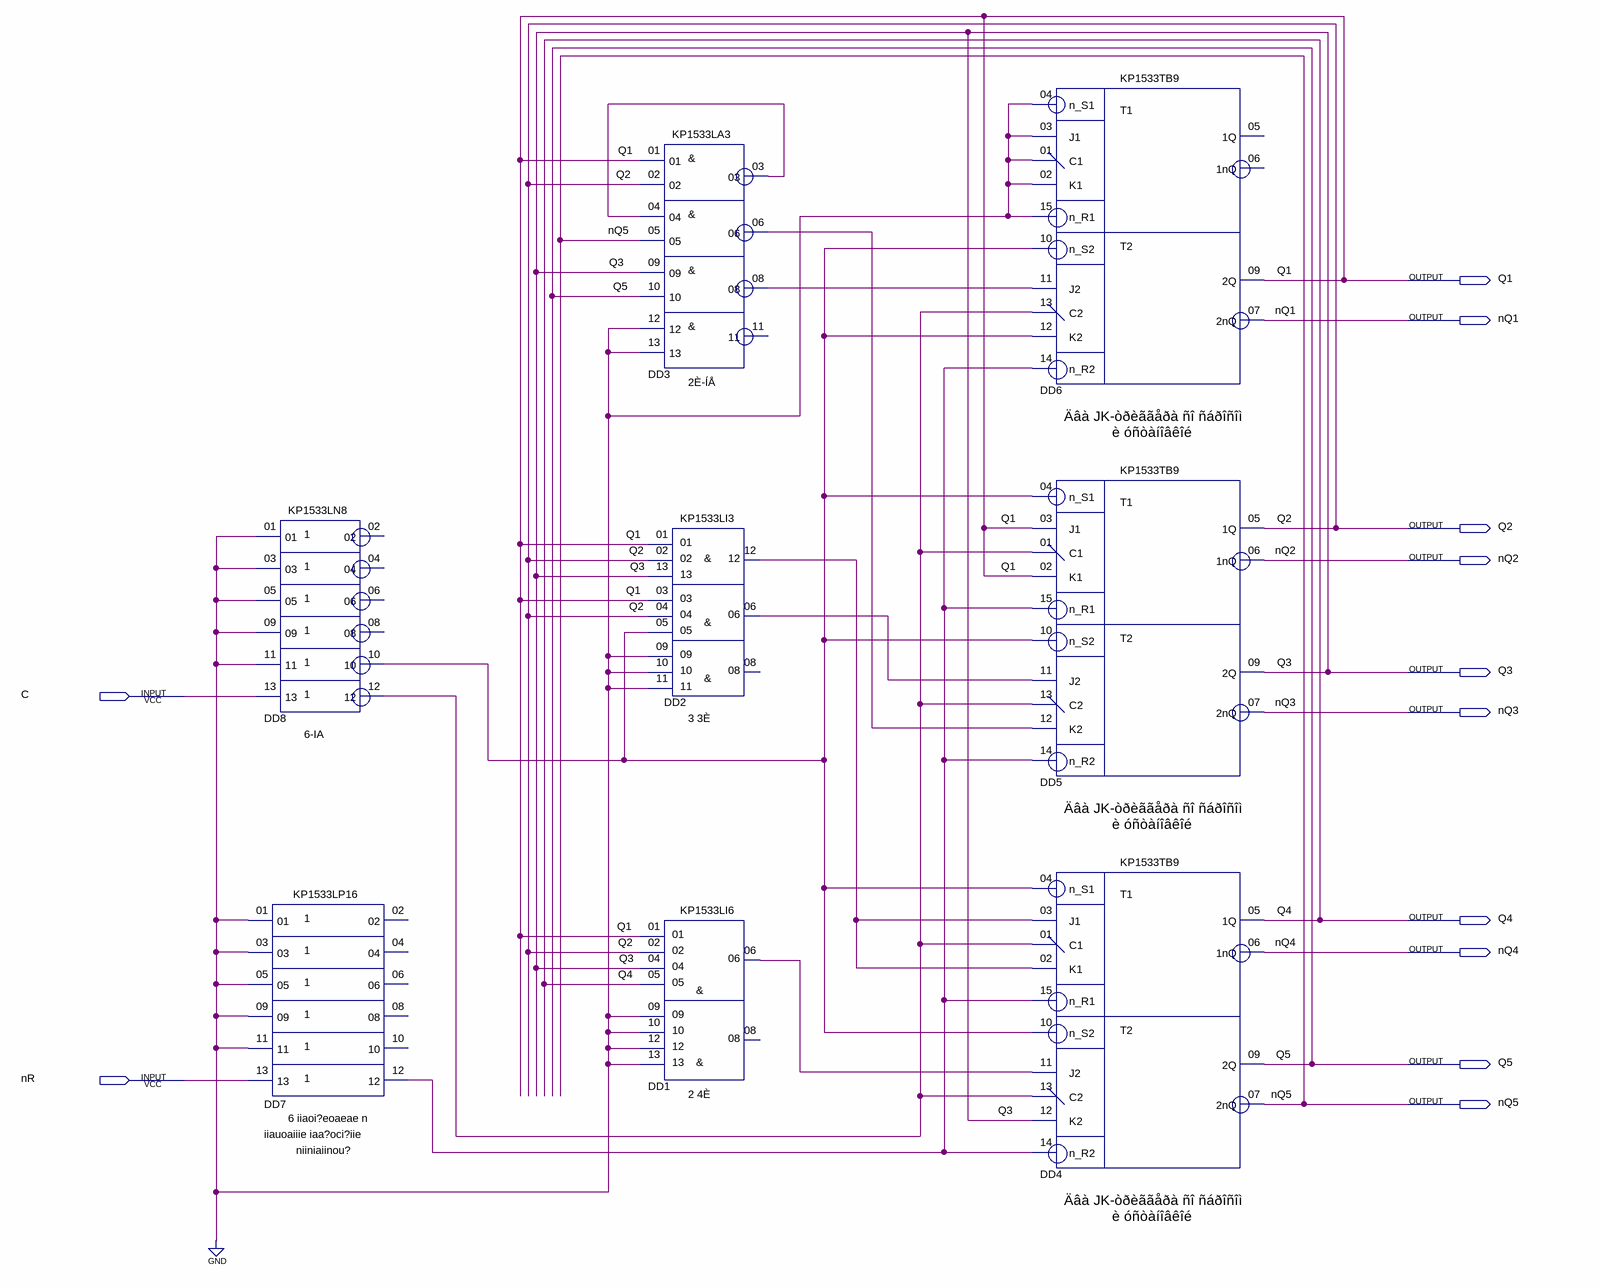
[diagram p0: schematic sheet]
// Quartus schematic BinaryCounterJKFF.bdf as structural Verilog: 8 symbols, 12 pins
module BinaryCounterJKFF (
  input  C,
  input  nR,
  output Q1,
  output nQ1,
  output Q2,
  output nQ2,
  output Q3,
  output nQ3,
  output Q4,
  output nQ4,
  output Q5,
  output nQ5
);

  wire DD1_06, DD2_06, DD2_12, DD3_03, DD3_06, DD3_08, DD7_12, DD8_10, DD8_12;

  KP1533LN8 DD8 (
    .\01 (1'b0), .\03 (1'b0), .\05 (1'b0), .\09 (1'b0), .\11 (1'b0), .\13 (C), .\10 (DD8_10), .\12 (DD8_12));  // open: 02, 04, 06, 08
  KP1533LP16 DD7 (
    .\01 (1'b0), .\03 (1'b0), .\05 (1'b0), .\09 (1'b0), .\11 (1'b0), .\13 (nR), .\12 (DD7_12));  // open: 02, 04, 06, 08, 10
  KP1533LA3 DD3 (
    .\01 (Q1), .\02 (Q2), .\04 (DD3_03), .\05 (nQ5), .\09 (Q3), .\10 (Q5), .\12 (1'b0), .\13 (1'b0),
    .\03 (DD3_03), .\06 (DD3_06), .\08 (DD3_08));  // open: 11
  KP1533LI3 DD2 (
    .\01 (Q1), .\02 (Q2), .\13 (Q3), .\03 (Q1), .\04 (Q2), .\05 (DD8_10), .\09 (1'b0), .\10 (1'b0),
    .\11 (1'b0), .\12 (DD2_12), .\06 (DD2_06));  // open: 08
  KP1533LI6 DD1 (
    .\01 (Q1), .\02 (Q2), .\04 (Q3), .\05 (Q4), .\09 (1'b0), .\10 (1'b0), .\12 (1'b0), .\13 (1'b0),
    .\06 (DD1_06));  // open: 08
  KP1533TB9 DD6 (
    .n_S1(1'b0), .J1(1'b0), .n_R1(1'b0), .C1(1'b0), .K1(1'b0), .n_S2(DD8_10), .J2(DD3_08), .n_R2(DD7_12),
    .C2(DD8_12), .K2(DD8_10), .\2Q (Q1), .\2nQ (nQ1));  // open: 1Q, 1nQ
  KP1533TB9 DD5 (
    .n_S1(DD8_10), .J1(Q1), .n_R1(DD7_12), .C1(DD8_12), .K1(Q1), .n_S2(DD8_10), .J2(DD2_06), .n_R2(DD7_12),
    .C2(DD8_12), .K2(DD3_06), .\1Q (Q2), .\1nQ (nQ2), .\2Q (Q3), .\2nQ (nQ3));
  KP1533TB9 DD4 (
    .n_S1(DD8_10), .J1(DD2_12), .n_R1(DD7_12), .C1(DD8_12), .K1(DD2_12), .n_S2(DD8_10), .J2(DD1_06),
    .n_R2(DD7_12), .C2(DD8_12), .K2(Q3), .\1Q (Q4), .\1nQ (nQ4), .\2Q (Q5), .\2nQ (nQ5));
endmodule
